# EAGLE design in12 (EAGLE 9.6.2)
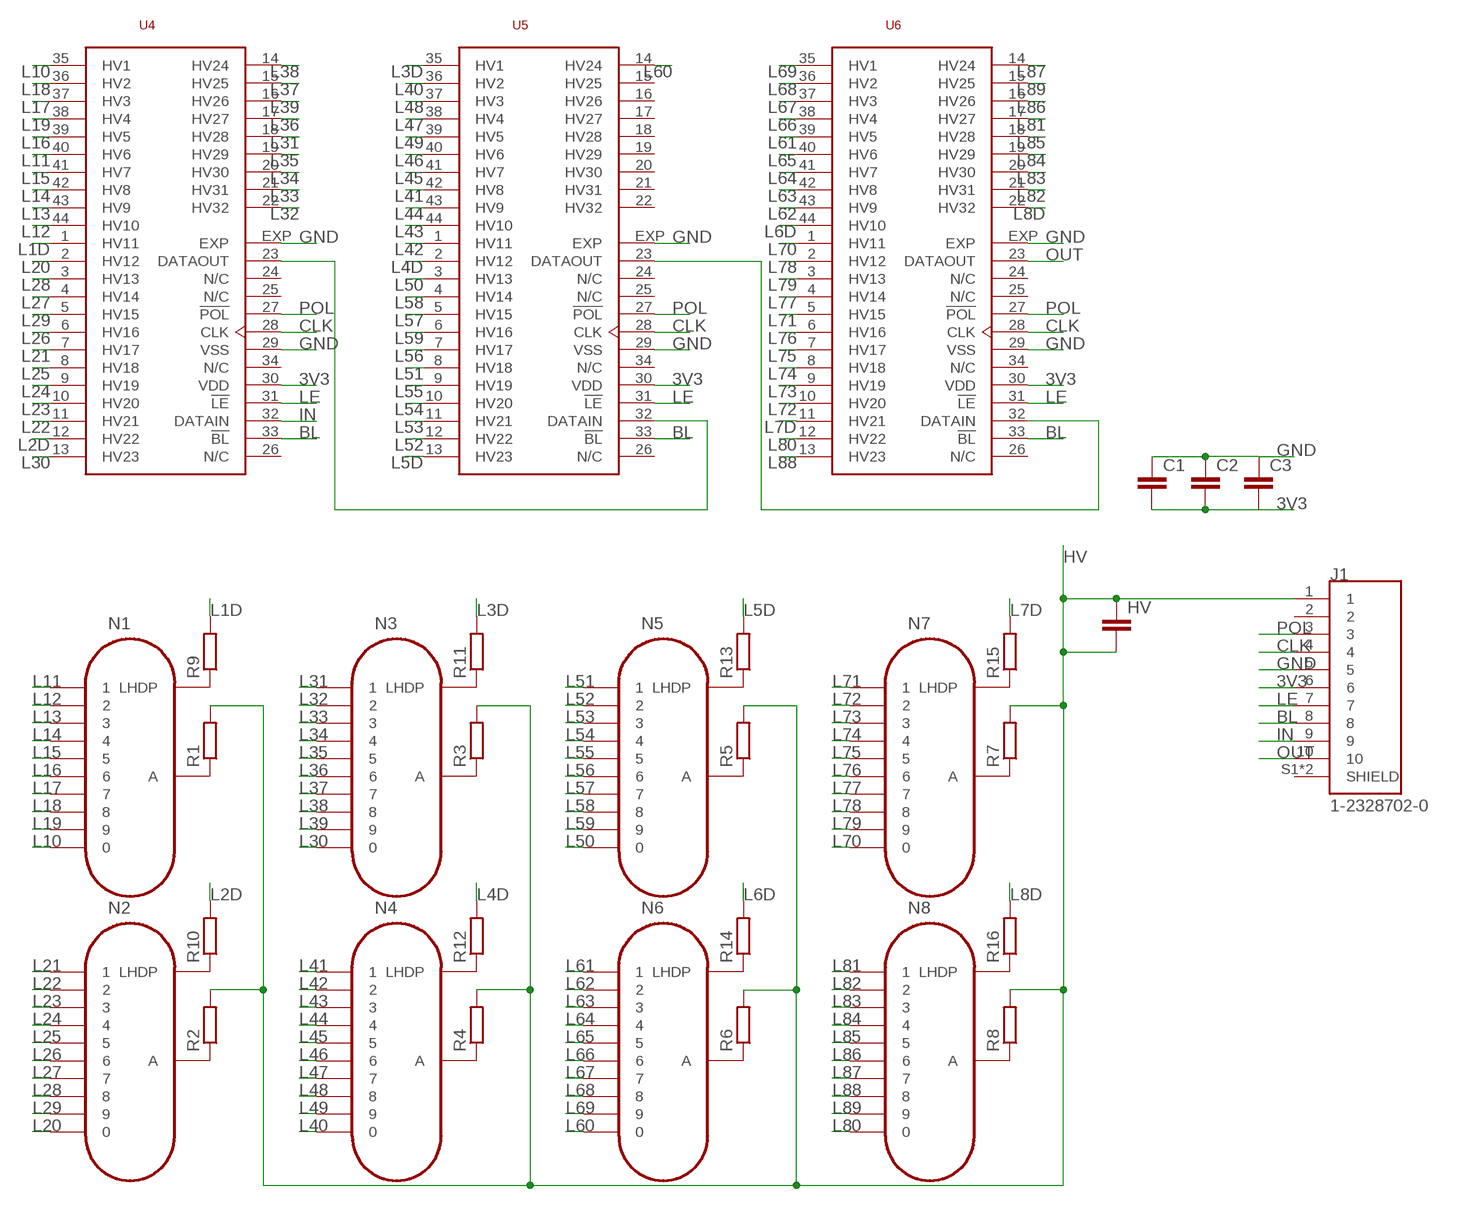
[diagram p0: schematic, sheet 1]

## Parts
C1  C-EUC0805  [C0805]
C2  C-EUC0805  [C0805]
C3  C-EUC0805  [C0805]
HV  C-EUC1206  [C1206]
J1  1-2328702-0  [TE_1-2328702-0]
N1  IN-12B  [IN-12]
N2  IN-12B  [IN-12]
N3  IN-12B  [IN-12]
N4  IN-12B  [IN-12]
N5  IN-12B  [IN-12]
N6  IN-12B  [IN-12]
N7  IN-12B  [IN-12]
N8  IN-12B  [IN-12]
R1  R-EU_R1206  [R1206]
R2  R-EU_R1206  [R1206]
R3  R-EU_R1206  [R1206]
R4  R-EU_R1206  [R1206]
R5  R-EU_R1206  [R1206]
R6  R-EU_R1206  [R1206]
R7  R-EU_R1206  [R1206]
R8  R-EU_R1206  [R1206]
R9  R-EU_R0805  [R0805]
R10  R-EU_R0805  [R0805]
R11  R-EU_R0805  [R0805]
R12  R-EU_R0805  [R0805]
R13  R-EU_R0805  [R0805]
R14  R-EU_R0805  [R0805]
R15  R-EU_R0805  [R0805]
R16  R-EU_R0805  [R0805]
U4  HV5523  [QFN-44-7X7]
U5  HV5523  [QFN-44-7X7]
U6  HV5523  [QFN-44-7X7]

## Nets
3V3: C1.2 C2.2 C3.2 J1.6 U4.30(VDD) U5.30(VDD) U6.30(VDD)
BL: J1.8 U4.33(!BL) U5.33(!BL) U6.33(!BL)
CLK: J1.4 U4.28(CLK) U5.28(CLK) U6.28(CLK)
GND: C1.1 C2.1 C3.1 J1.5 U4.29(VSS) U4.EXP U5.29(VSS) U5.EXP U6.29(VSS) U6.EXP
HV: HV.1 HV.2 J1.1 R1.2 R2.2 R3.2 R4.2 R5.2 R6.2 R7.2 R8.2
IN: J1.9 U4.32(DATAIN)
L1D: R9.2 U4.1(HV11)
L2D: R10.2 U4.12(HV22)
L3D: R11.2 U5.35(HV1)
L4D: R12.2 U5.2(HV12)
L5D: R13.2 U5.13(HV23)
L6D: R14.2 U6.44(HV10)
L7D: R15.2 U6.11(HV21)
L8D: R16.2 U6.22(HV32)
L10: N1.0 U4.35(HV1)
L11: N1.1 U4.40(HV6)
L12: N1.2 U4.44(HV10)
L13: N1.3 U4.43(HV9)
L14: N1.4 U4.42(HV8)
L15: N1.5 U4.41(HV7)
L16: N1.6 U4.39(HV5)
L17: N1.7 U4.37(HV3)
L18: N1.8 U4.36(HV2)
L19: N1.9 U4.38(HV4)
L20: N2.0 U4.2(HV12)
L21: N2.1 U4.7(HV17)
L22: N2.2 U4.11(HV21)
L23: N2.3 U4.10(HV20)
L24: N2.4 U4.9(HV19)
L25: N2.5 U4.8(HV18)
L26: N2.6 U4.6(HV16)
L27: N2.7 U4.4(HV14)
L28: N2.8 U4.3(HV13)
L29: N2.9 U4.5(HV15)
L30: N3.0 U4.13(HV23)
L31: N3.1 U4.18(HV28)
L32: N3.2 U4.22(HV32)
L33: N3.3 U4.21(HV31)
L34: N3.4 U4.20(HV30)
L35: N3.5 U4.19(HV29)
L36: N3.6 U4.17(HV27)
L37: N3.7 U4.15(HV25)
L38: N3.8 U4.14(HV24)
L39: N3.9 U4.16(HV26)
L40: N4.0 U5.36(HV2)
L41: N4.1 U5.42(HV8)
L42: N4.2 U5.1(HV11)
L43: N4.3 U5.44(HV10)
L44: N4.4 U5.43(HV9)
L45: N4.5 U5.41(HV7)
L46: N4.6 U5.40(HV6)
L47: N4.7 U5.38(HV4)
L48: N4.8 U5.37(HV3)
L49: N4.9 U5.39(HV5)
L50: N5.0 U5.3(HV13)
L51: N5.1 U5.8(HV18)
L52: N5.2 U5.12(HV22)
L53: N5.3 U5.11(HV21)
L54: N5.4 U5.10(HV20)
L55: N5.5 U5.9(HV19)
L56: N5.6 U5.7(HV17)
L57: N5.7 U5.5(HV15)
L58: N5.8 U5.4(HV14)
L59: N5.9 U5.6(HV16)
L60: N6.0 U5.14(HV24)
L61: N6.1 U6.39(HV5)
L62: N6.2 U6.43(HV9)
L63: N6.3 U6.42(HV8)
L64: N6.4 U6.41(HV7)
L65: N6.5 U6.40(HV6)
L66: N6.6 U6.38(HV4)
L67: N6.7 U6.37(HV3)
L68: N6.8 U6.36(HV2)
L69: N6.9 U6.35(HV1)
L70: N7.0 U6.1(HV11)
L71: N7.1 U6.5(HV15)
L72: N7.2 U6.10(HV20)
L73: N7.3 U6.9(HV19)
L74: N7.4 U6.8(HV18)
L75: N7.5 U6.7(HV17)
L76: N7.6 U6.6(HV16)
L77: N7.7 U6.4(HV14)
L78: N7.8 U6.2(HV12)
L79: N7.9 U6.3(HV13)
L80: N8.0 U6.12(HV22)
L81: N8.1 U6.17(HV27)
L82: N8.2 U6.21(HV31)
L83: N8.3 U6.20(HV30)
L84: N8.4 U6.19(HV29)
L85: N8.5 U6.18(HV28)
L86: N8.6 U6.16(HV26)
L87: N8.7 U6.14(HV24)
L88: N8.8 U6.13(HV23)
L89: N8.9 U6.15(HV25)
LE: J1.7 U4.31(!LE) U5.31(!LE) U6.31(!LE)
N$1: N1.A R1.1
N$2: N2.A R2.1
N$3: N3.A R3.1
N$4: N4.A R4.1
N$5: N5.A R5.1
N$6: N6.A R6.1
N$7: N7.A R7.1
N$8: N8.A R8.1
N$9: N1.LHDP R9.1
N$10: N2.LHDP R10.1
N$11: N3.LHDP R11.1
N$12: N4.LHDP R12.1
N$13: N5.LHDP R13.1
N$14: N6.LHDP R14.1
N$15: N7.LHDP R15.1
N$16: N8.LHDP R16.1
N$17: U4.23(DATAOUT) U5.32(DATAIN)
N$18: U5.23(DATAOUT) U6.32(DATAIN)
OUT: J1.10 U6.23(DATAOUT)
POL: J1.3 U4.27(!POL) U5.27(!POL) U6.27(!POL)
Unconnected: J1.2 J1.S1(SHIELD) J1.S2(SHIELD) U4.24(N/C) U4.25(N/C) U4.26(N/C) U4.34(N/C) U5.15(HV25) U5.16(HV26) U5.17(HV27) U5.18(HV28) U5.19(HV29) U5.20(HV30) U5.21(HV31) U5.22(HV32) U5.24(N/C) U5.25(N/C) U5.26(N/C) U5.34(N/C) U6.24(N/C) U6.25(N/C) U6.26(N/C) U6.34(N/C)

## Library data of the parts
C1-C3 HV = rcl:C-EU: CAPACITOR, European symbol; SPICEPREFIX: C
J1 = 1-2328702-0:1-2328702-0: Receptacle Connector 10PIN 0.5MMP FPC CONN, BACK FLIP LOCK 10 POS Check availability <https://pricing.snapeda.com/parts/1-2328702-0/TE%20Connectivity/view-part?ref=eda>; AVAILABILITY: In Stock; CHECK_PRICES: https://www.snapeda.com/parts/1-2328702-0/TE+Connectivity+AMP+Connectors/view-part/?ref=eda; COMMENT: 1-2328702-0; DESCRIPTION: FPC Connector; 0.5mm pitch dual contact back flip FPC, 10pos | TE Connectivity 1-2328702-0; MF: TE Connectivity; MP: 1-2328702-0; PACKAGE: None; PRICE: None; PURCHASE-URL: https://www.snapeda.com/api/url_track_click_mouser/?unipart_id=3106381&manufacturer=TE Connectivity&part_name=1-2328702-0&search_term=1-2328702-0; SNAPEDA_LINK: https://www.snapeda.com/parts/1-2328702-0/TE+Connectivity+AMP+Connectors/view-part/?ref=snap
N1-N8 = russian-nixies:IN-12B: IN-12B: medium numeric topview nixie tube
R1-R16 = rcl:R-EU_: RESISTOR, European symbol; SPICEPREFIX: R
U4-U6 = nixiemisc:HV5523

## Board
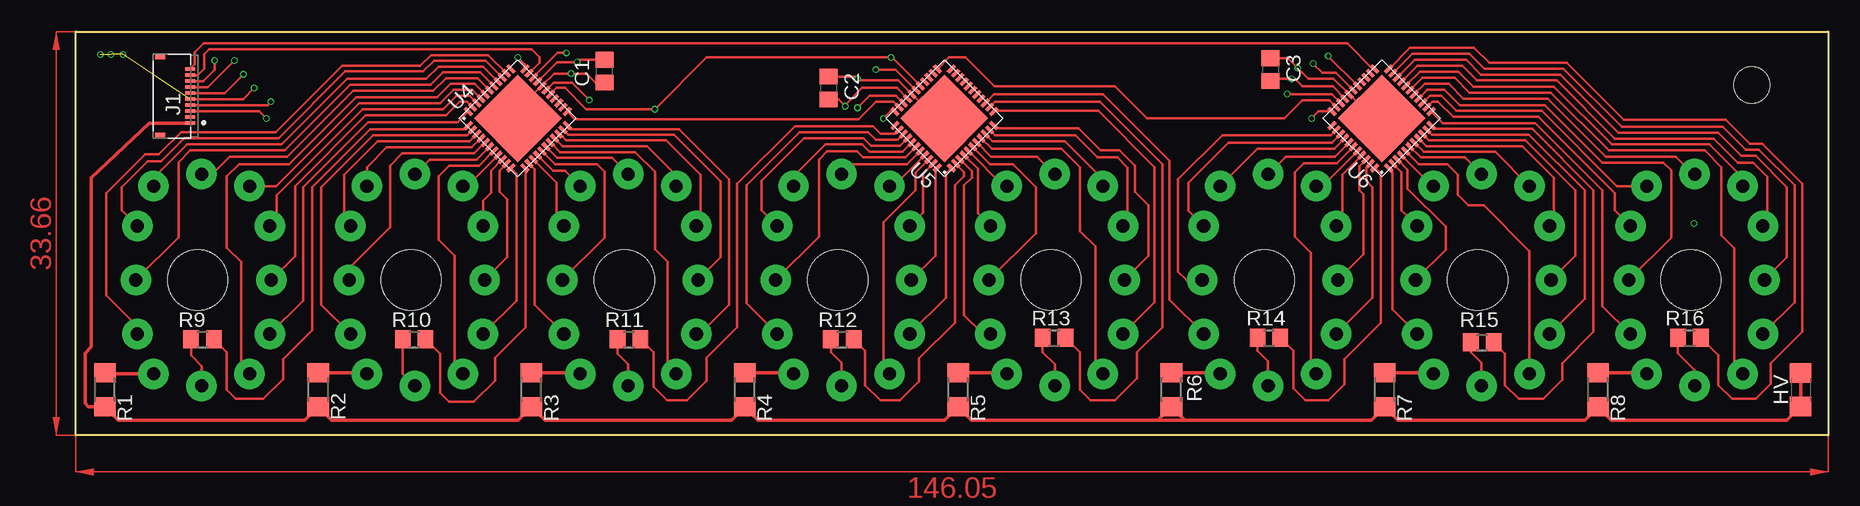
[diagram p1: board, top side]
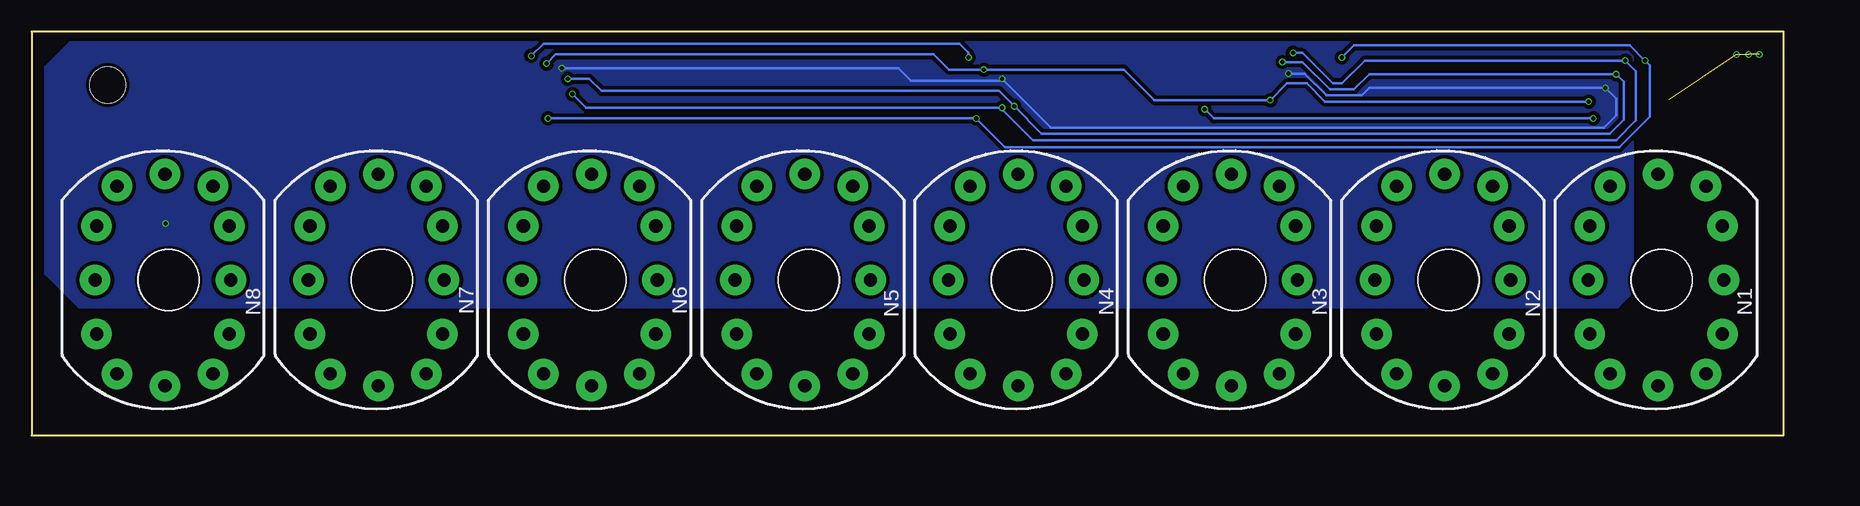
[diagram p2: board, bottom side, seen from below]

Size 146.05 x 33.66 mm. Coordinates in mm from the lower left corner, seen from the top.
Outline: 0,0 0,33.66 146.05,33.66 146.05,0 0,0
Copper layers (1*16): Top 0.035mm / dielectric 1.5mm / Bottom 0.035mm
Design rules "PCBWay_2L_100um-Track": minimum track width 0.1mm, minimum drill 0.3mm, track to track 0.1mm, track to pad 0.1mm, pad to pad 0.1mm, via to via 0.1mm, smd to smd 0mil, copper to edge 0.3mm, drill to drill 10mil, minimum pad ring 6mil, minimum via ring 0.1mm, stop-mask expansion 2mil, vias tented up to drill 0.45mm, thermal gap 0.2mm
Holes 3 mm at 139.7,29.21

### Footprints (pad centres in the part's own frame; a part is rotated, then mirrored left to right if it is on the bottom)
C0805 = smd 1.3 x 1.5: 1 -0.95,0; 2 0.95,0
C1206 = smd 1.6 x 1.8: 1 -1.4,0; 2 1.4,0
TE_1-2328702-0 = smd 0.3 x 0.8: 1 0,0; 2 -0.5,0; 3 -1,0; 4 -1.5,0; 5 -2,0; 6 -2.5,0; 7 -3,0; 8 -3.5,0; 9 -4,0; 10 -4.5,0 | smd 0.4 x 0.8: S1 1,-2.5; S2 -5.5,-2.5
IN-12 = drill 1.1 pad 2.54: 0 5.048,-4.5; 1 -4.317,-7.817; 2 -6,-4.5; 3 -6.127,0; 4 -6,4.5; 5 -4.317,7.817; 6 -0.318,8.818; 7 3.683,7.817; 8 5.048,4.5; 9 5.175,0; A 3.683,-7.817; LHDP -0.318,-8.818 | hole 5: 0,0
R1206 = smd 1.6 x 1.803: 1 -1.422,0; 2 1.422,0
R0805 = smd 1.3 x 1.5: 1 -0.95,0; 2 0.95,0
QFN-44-7X7 = smd 0.8 x 0.3: 1 -3.325,2.5; 2 -3.325,2; 3 -3.325,1.5; 4 -3.325,1; 5 -3.325,0.5; 6 -3.325,0; 7 -3.325,-0.5; 8 -3.325,-1; 9 -3.325,-1.5; 10 -3.325,-2; 11 -3.325,-2.5; 23 3.325,-2.5; 24 3.325,-2; 25 3.325,-1.5; 26 3.325,-1; 27 3.325,-0.5; 28 3.325,0; 29 3.325,0.5; 30 3.325,1; 31 3.325,1.5; 32 3.325,2; 33 3.325,2.5 | smd 0.3 x 0.8: 12 -2.5,-3.325; 13 -2,-3.325; 14 -1.5,-3.325; 15 -1,-3.325; 16 -0.5,-3.325; 17 0,-3.325; 18 0.5,-3.325; 19 1,-3.325; 20 1.5,-3.325; 21 2,-3.325; 22 2.5,-3.325; 34 2.5,3.325; 35 2,3.325; 36 1.5,3.325; 37 1,3.325; 38 0.5,3.325; 39 0,3.325; 40 -0.5,3.325; 41 -1,3.325; 42 -1.5,3.325; 43 -2,3.325; 44 -2.5,3.325 | smd 5.15 x 5.15: EXP 0,0

### Placement (x,y rotation side)
C1  44.07,30.35 90 top
C2  62.74,28.96 270 top
C3  99.57,30.48 270 top
HV  143.76,3.81 270 top
J1  9.53,26.04 270 top
N1  10.16,12.95 0 bottom
N2  27.94,12.95 0 bottom
N3  45.72,12.95 0 bottom
N4  63.5,12.95 0 bottom
N5  81.28,12.95 0 bottom
N6  99.06,12.95 0 bottom
N7  116.84,12.95 0 bottom
N8  134.62,12.95 0 bottom
R1  2.41,3.81 270 top
R2  20.19,3.81 270 top
R3  37.97,3.81 270 top
R4  55.75,3.81 270 top
R5  73.53,3.81 270 top
R6  91.31,3.81 270 top
R7  109.09,3.81 270 top
R8  126.87,3.81 270 top
R9  10.54,8 0 top
R10  28.19,8 0 top
R11  46.1,8 0 top
R12  63.88,8 0 top
R13  81.53,8.13 0 top
R14  99.44,8.13 0 top
R15  117.22,7.75 0 top
R16  134.49,8.13 0 top
U4  36.83,26.42 45 top
U5  72.39,26.42 135 top
U6  108.84,26.42 135 top

### Tracks (layer width: path | path; a pad name or v marks a point on that pad's centre or on a via)
3V3  (via drill 0.35)
  Top 0.203: J1.6 12.41,28.54 v13.97,30.1 | U4.30 40.12,31.11 v41.78,31.11 41.97,31.3 C1.2 | U6.30 104.76,29.08 102.23,29.08 101.6,29.72 v101.35,29.72 99.57,29.72 C3.2 | U5.30 68.44,28.96 65.53,28.96 64.14,27.56 v64.14,27.43 63.56,28.01 C2.2
  Bottom 0.203: v41.78,31.11 40.13,31.11 37.85,28.83 35.81,28.83 34.54,30.1 v13.97,30.1 13.34,29.46 13.34,26.29 14.48,25.15 61.85,25.15 v64.14,27.43 65.41,28.7 98.55,28.7 99.57,29.72 v101.35,29.72
BL  (via drill 0.35)
  Top 0.203: J1.8 10.61,29.54 11.56,30.48 v11.56,31.24 | v36.83,31.5 37.41,30.91 U4.33 | v67.31,26.42 67.89,27 U5.33 | v103,26.42 103.58,27 U6.33
  Bottom 0.203: v36.83,31.5 35.81,32.51 12.83,32.51 v11.56,31.24 11.18,30.86 11.18,26.54 13.72,24 64.9,24 v67.31,26.42 v103,26.42
CLK  (via drill 0.35)
  Top 0.203: U6.28 105.03,30.23 103.89,30.23 v103.12,30.99 | v66.67,30.48 68.33,30.48 U5.28 | U4.28 39.81,29.4 41.34,29.4 v42.8,27.94 | v16.26,27.81 15.98,27.54 J1.4
  Bottom 0.203: v103.12,30.99 102.36,31.75 70.87,31.75 69.6,30.48 v66.67,30.48 54.99,30.48 52.45,27.94 v42.8,27.94 41.4,29.34 39.75,29.34 38.23,27.81 v16.26,27.81
GND  (via drill 0.35)  (3 unrouted)
  Top 0.203: U5.EXP 71.68,26.42 U5.29 68.51,29.59 65.28,29.59 v65.15,29.72 64.96,29.91 C2.1 | U6.EXP 108.13,26.42 U6.29 104.83,29.72 102.75,29.72 v101.86,30.61 v101.85,30.61 101.03,31.43 C3.1 | U4.EXP 36.83,27.12 U4.29 39.87,30.16 v41.27,30.16 42.55,30.16 43.31,29.4 C1.1 | J1.5 13.94,28.04 v14.86,28.96
  Bottom 0.203: v41.27,30.16 39.94,30.16 38.12,28.35 35.15,28.35 34.54,28.96 v14.86,28.96 13.97,28.07 13.97,26.67 14.98,25.66 61.09,25.66 v65.15,29.72 65.3,29.57 72.75,29.57 73.79,30.61 v101.85,30.61
  other vias: 2.03,31.75 2.92,31.75 3.94,31.75 134.87,17.65
  pour Bottom (isolate 0.305): 12.57,32.77 12.57,11.94 13.84,10.67 142.11,10.67 144.78,13.34 144.91,13.46 144.91,30.73 142.88,32.77
HV
  Top 0.305: 90.19,1.27 74.65,1.27 R5.2 72.42,1.27 56.87,1.27 R4.2 54.63,1.27 39.09,1.27 R3.2 36.85,1.27 21.31,1.27 R2.2 19.07,1.27 3.53,1.27 R1.2 1.04,2.39 0.76,2.67 0.76,6.86 1.29,7.38 1.29,21.47 6.12,26.04 J1.1 | 90.19,1.27 92.43,1.27 | 92.43,1.27 107.97,1.27 R7.2 110.21,1.27 125.75,1.27 R8.2 127.99,1.27 142.62,1.27 HV.2 HV.1 | 92.43,1.27 R6.2 90.19,1.27
IN
  Top 0.203: J1.9 10.16,30.04 10.7,30.57 10.7,31.78 11.1,32.18 37.97,32.18 38.65,31.5 38.65,31.07 U4.32
L1D
  Top 0.203: U4.1 32.41,25.53 29.8,25.53 24.53,25.53 19.68,20.69 19.68,8.76 17.27,6.35 17.27,4.7 15.62,3.05 13.34,3.05 12.57,3.81 12.57,6.92 R9.2
L2D
  Top 0.203: U4.12 37.47,22.25 37.47,9.02 34.92,6.48 34.92,4.57 33.15,2.79 31.11,2.79 30.35,3.56 30.35,6.79 R10.2
L3D
  Top 0.203: U5.35 68.29,25.15 67.06,25.15 66.42,25.78 59.94,25.78 55.12,20.95 55.12,9.02 52.58,6.48 52.58,4.57 50.93,2.92 49.28,2.92 48.13,4.06 48.13,6.92 R11.2
L4D
  Top 0.203: U5.2 74.04,21.94 74.04,21.59 73.28,20.83 73.28,9.4 70.29,6.41 70.29,4.51 68.71,2.92 67.06,2.92 65.79,4.19 65.79,7.05 R12.2
L5D
  Top 0.203: U5.13 76.61,27.81 85.34,27.81 90.55,22.6 90.55,9.02 88.46,6.92 88.46,4.76 86.61,2.92 84.58,2.92 83.69,3.81 83.69,6.92 R13.2
L6D
  Top 0.203: U6.44 108.76,21.79 108.76,9.4 105.73,6.36 105.73,4.25 104.39,2.92 102.49,2.92 101.47,3.94 101.47,7.05 R14.2
L7D
  Top 0.203: U6.11 113.25,25.55 121.39,25.55 126.49,20.45 126.49,8.64 123.89,6.03 123.89,4.64 122.3,3.05 120.27,3.05 119.13,4.19 119.13,6.79 R15.2
L8D
  Top 0.203: U6.22 111.19,32.3 116.54,32.3 117.81,31.04 124.28,31.04 129.03,26.29 137.54,26.29 139.53,24.3 140.55,24.3 143.89,20.95 143.89,8.64 141.25,6 141.25,4.29 140.01,3.05 138.05,3.05 136.91,4.19 136.91,6.67 R16.2
L10
  Top 0.203: N1.0 5.11,9.11 2.54,11.68 2.54,20.19 5.78,23.43 6.92,23.43 8.76,25.27 16.65,25.27 22.18,30.81 28.7,30.81 29.59,31.7 34.38,31.7 U4.35
L11
  Top 0.203: N1.1 13.78,5.84 13.78,14.45 12.57,15.66 12.57,21.59 13.59,22.61 17.79,22.61 23.35,28.17 30.11,28.17 31.24,29.3 33.23,29.3 U4.40
L12
  Top 0.203: N1.2 18.95,11.24 18.95,20.7 24.36,26.11 31.82,26.11 U4.44
L13
  Top 0.203: N1.3 18.26,14.93 18.26,20.77 24.16,26.67 30.87,26.67 32,27.8 32.61,27.8 U4.43
L14
  Top 0.203: N1.4 16.74,18.03 16.74,20 23.89,27.16 30.61,27.16 31.75,28.3 32.82,28.3 U4.42
L15
  Top 0.203: U4.41 33.03,28.8 31.5,28.8 30.38,27.69 23.62,27.69 16.71,20.77 N1.5
L16
  Top 0.203: U4.39 33.48,29.77 30.86,29.77 29.79,28.7 23.11,28.7 17.63,23.22 12.8,23.22 11.36,21.77 N1.6
L17
  Top 0.203: N1.7 6.35,20.9 6.35,21.34 9.27,24.26 17.14,24.26 22.61,29.72 29.21,29.72 30.23,30.73 33.93,30.73 U4.37
L18
  Top 0.203: N1.8 3.81,18.76 3.81,20.7 5.97,22.86 7.11,22.86 9.02,24.77 16.9,24.77 22.46,30.33 28.96,30.33 29.84,31.22 34.15,31.22 U4.36
L19
  Top 0.203: U4.38 33.7,30.25 30.61,30.25 29.57,29.21 22.86,29.21 17.4,23.75 9.53,23.75 8.57,22.79 8.57,16.53 N1.9
L20
  Top 0.203: N2.0 20.45,10.9 20.45,20.69 24.77,25.02 32.6,25.02 U4.2
L21
  Top 0.203: N2.1 31.56,5.84 31.56,14.96 30.23,16.29 30.23,21.59 31.11,22.48 33.6,22.48 U4.7
L22
  Top 0.203: N2.2 36.73,11.24 36.73,21.82 U4.11
L23
  Top 0.203: N2.3 35.94,14.83 35.94,19.68 35.31,20.32 35.31,22.06 U4.10
L24
  Top 0.203: N2.4 33.94,19.56 34.59,20.21 34.59,22.05 U4.9
L25
  Top 0.203: U4.8 32.6,20.77 N2.5
L26
  Top 0.203: U4.6 33.4,22.99 29.47,22.99 N2.6
L27
  Top 0.203: N2.7 24.26,22.35 25.91,24 33,24 U4.4
L28
  Top 0.203: U4.3 32.8,24.51 25.15,24.51 22.35,21.71 22.35,17.99 N2.8
L29
  Top 0.203: U4.5 33.2,23.5 27.19,23.5 26.18,22.49 26.18,17.37 22.77,13.95 N2.9
L30
  Top 0.203: N3.0 38.23,10.9 38.23,22.19 U4.13
L31
  Top 0.203: N3.1 49.34,5.84 49.34,14.45 48.26,15.53 48.26,21.96 46.61,23.61 40.35,23.61 U4.18
L32
  Top 0.203: N3.2 52.04,8.45 54.46,10.87 54.46,21.36 50.29,25.53 41.25,25.53 U4.22
L33
  Top 0.203: N3.3 53.72,14.83 53.72,21.2 49.86,25.06 41.01,25.06 U4.21
L34
  Top 0.203: N3.4 52.07,17.8 52.07,21.71 49.2,24.58 40.84,24.58 40.29,25.13 U4.20
L35
  Top 0.203: N3.5 50.04,21.66 47.6,24.1 40.56,24.1 U4.19
L36
  Top 0.203: N3.6 44.69,23.12 40.12,23.12 U4.17
L37
  Top 0.203: N3.7 40.77,22.04 40.77,22.05 39.78,22.05 U4.15
L38
  Top 0.203: N3.8 40.07,18.05 40.07,21.05 U4.14
L39
  Top 0.203: N3.9 44.07,16.48 44.07,21.97 43.43,22.61 39.93,22.61 U4.16
L40
  Top 0.203: N4.0 55.88,11.03 55.88,20.83 60.33,25.27 66.04,25.27 66.67,24.64 68.49,24.64 U5.36
L41
  Top 0.203: N4.1 67.31,5.64 67.31,17.78 69.98,20.45 69.98,21.88 U5.42
L42
  Top 0.203: N4.2 72.52,11.47 72.52,21.84 U5.1
L43
  Top 0.203: N4.3 71.66,14.99 71.66,22.13 71.81,22.28 U5.44
L44
  Top 0.203: U5.43 70.61,21.81 70.61,18.57 N4.4
L45
  Top 0.203: U5.41 68.22,20.83 67.87,20.83 N4.5
L46
  Top 0.203: N4.6 64.65,22.61 69.29,22.61 U5.40
L47
  Top 0.203: U5.38 68.91,23.65 66.15,23.65 65.54,24.26 62.48,24.26 59.82,21.59 N4.7
L48
  Top 0.203: N4.8 57.15,18.76 57.15,21.21 60.71,24.77 65.66,24.77 66.29,24.13 68.69,24.13 U5.37
L49
  Top 0.203: N4.9 61.93,16.56 61.93,22.99 62.62,23.68 65.11,23.68 65.62,23.16 69.14,23.16 U5.39
L50
  Top 0.203: N5.0 75.62,8.45 74.04,10.03 74.04,20.83 74.68,21.46 74.68,22.01 U5.3
L51
  Top 0.203: U5.8 76.34,23.88 82.17,23.88 83.69,22.35 83.69,17.02 84.96,15.75 84.96,5.77 N5.1
L52
  Top 0.203: N5.2 89.92,11.09 89.92,22.35 85.22,27.05 76.56,27.05 U5.12
L53
  Top 0.203: N5.3 89.41,14.96 89.41,19.18 88.27,20.32 88.27,22.48 87,23.75 85.4,23.75 83.57,25.58 76.76,25.58 U5.11
L54
  Top 0.203: N5.4 87.66,17.84 87.66,22.32 86.81,23.18 85.15,23.18 83.31,25.02 76.61,25.02 U5.10
L55
  Top 0.203: U5.9 76.42,24.51 82.42,24.51 85.6,21.34 N5.5
L56
  Top 0.203: U5.7 76.27,23.24 80.13,23.24 N5.6
L57
  Top 0.203: U5.5 77.33,20.77 N5.7
L58
  Top 0.203: U5.4 75.18,22.21 75.18,18.5 N5.8
L59
  Top 0.203: N5.9 80.01,16.86 80.01,20.7 78.11,22.61 76.2,22.61 U5.6
L60
  Top 0.203: N6.0 91.16,11.31 91.16,22.89 85.6,28.45 76.54,28.45 U5.14
L61
  Top 0.203: N6.1 102.93,5.58 102.93,15.21 101.6,16.55 101.6,21.91 102.37,22.68 105.11,22.68 U6.39
L62
  Top 0.203: U6.43 107.57,22.32 107.57,21.21 108.08,20.7 108.08,11.47 N6.2
L63
  Top 0.203: U6.42 106.97,22.42 106.97,20.45 107.31,20.1 107.31,15.08 N6.3
L64
  Top 0.203: N6.4 105.57,17.96 105.57,21.73 U6.41
L65
  Top 0.203: N6.5 103.9,20.77 U6.40
L66
  Top 0.203: N6.6 100.85,23.24 104.96,23.24 U6.38
L67
  Top 0.203: N6.7 98.48,23.88 104.9,23.88 105.78,24.75 U6.37
L68
  Top 0.203: N6.8 92.74,18.72 92.74,21.05 96.07,24.38 104.69,24.38 U6.36
L69
  Top 0.203: N6.9 92.55,12.95 91.87,13.63 91.87,21.34 95.55,25.02 104.61,25.02 U6.35
L70
  Top 0.203: N7.0 109.73,10.52 109.73,21.99 U6.1
L71
  Top 0.203: N7.1 121.16,15.37 117.35,19.18 116.08,19.18 115.19,20.07 115.19,21.72 114.3,22.61 111.94,22.61 U6.5
L72
  Top 0.203: N7.2 125.75,11.37 125.75,20.42 121.11,25.06 113.02,25.06 U6.10
L73
  Top 0.203: N7.3 124.97,14.96 124.97,20.45 120.81,24.61 112.77,24.61 U6.9
L74
  Top 0.203: N7.4 123.19,17.8 123.19,21.46 120.55,24.11 112.56,24.11 U6.8
L75
  Top 0.203: U6.7 112.34,23.62 118.31,23.62 N7.5
L76
  Top 0.203: N7.6 115.77,23.16 112.09,23.16 U6.6
L77
  Top 0.203: U6.4 113.07,20.77 N7.7
L78
  Top 0.203: N7.8 110.49,18.76 110.49,21.94 U6.2
L79
  Top 0.203: N7.9 114.19,15.48 114.19,17.38 111,20.57 111,22.14 U6.3
L80
  Top 0.203: N8.0 127.25,10.77 127.25,20.45 121.67,26.04 113.92,26.04 U6.12
L81
  Top 0.203: N8.1 138.24,5.84 138.24,15.6 137.16,16.67 137.16,22.35 135.76,23.75 127.76,23.75 122.94,28.57 116.17,28.57 114.94,29.8 112.23,29.8 U6.17
L82
  Top 0.203: N8.2 143.26,11.09 143.26,20.83 140.27,23.81 139.18,23.81 137.29,25.7 128.84,25.7 123.99,30.56 117.4,30.56 116.15,31.8 111.4,31.8 U6.21
L83
  Top 0.203: N8.3 142.62,14.83 142.62,20.7 140.02,23.3 138.82,23.3 136.91,25.22 128.57,25.22 123.72,30.07 117.12,30.07 115.89,31.3 111.61,31.3 U6.20
L84
  Top 0.203: N8.4 141,17.84 141,21.56 139.83,22.73 138.53,22.73 136.53,24.74 128.29,24.74 123.44,29.59 116.78,29.59 115.57,30.8 111.81,30.8 U6.19
L85
  Top 0.203: N8.5 138.94,21.46 136.14,24.26 128.01,24.26 123.21,29.06 116.48,29.06 115.24,30.3 112.02,30.3 U6.18
L86
  Top 0.203: U6.16 112.44,29.3 114.43,29.3 115.67,28.07 122.68,28.07 127.51,23.24 133.35,23.24 134.82,21.77 N8.6
L87
  Top 0.203: U6.14 112.85,28.3 113.81,28.3 115.06,27.05 122.17,27.05 128.45,20.77 N8.7
L88
  Top 0.203: N8.8 128.27,18.76 128.27,20.19 121.92,26.54 114.8,26.54 113.54,27.8 113.06,27.8 U6.13
L89
  Top 0.203: N8.9 132.97,16.48 132.97,22.1 132.33,22.73 127.25,22.73 122.45,27.53 115.34,27.53 114.07,28.8 112.64,28.8 U6.15
LE  (via drill 0.35)
  Top 0.203: J1.7 11,29.04 v13.21,31.24 | v40.89,31.88 40.17,31.88 U4.31 | U6.31 104.69,28.45 v100.97,28.45 | U5.31 68.36,28.32 66.17,28.32 v65.15,27.3
  Bottom 0.203: v40.89,31.88 40.13,31.88 37.59,29.34 36.83,29.34 34.92,31.24 v13.21,31.24 12.32,30.35 12.32,26.26 13.97,24.61 62.59,24.61 65.15,27.17 v65.15,27.3 99.82,27.3 v100.97,28.45
N$1
  Top 0.305: R1.1 2.51,5.14 N1.A
N$2
  Top 0.305: R2.1 24.16,5.23 N2.A
N$3
  Top 0.305: R3.1 41.94,5.23 N3.A
N$4
  Top 0.305: R4.1 59.72,5.23 N4.A
N$5
  Top 0.305: R5.1 77.5,5.23 N5.A
N$6
  Top 0.305: R6.1 95.28,5.23 N6.A
N$7
  Top 0.305: R7.1 113.06,5.23 N7.A
N$8
  Top 0.305: R8.1 130.84,5.23 N8.A
N$9
  Top 0.203: R9.1 9.59,6.67 10.48,5.78 N1.LHDP
N$10
  Top 0.203: R10.1 27.24,5.15 N2.LHDP
N$11
  Top 0.203: R11.1 45.15,6.8 46.04,5.92 N3.LHDP
N$12
  Top 0.203: R12.1 62.93,6.93 63.82,6.04 N4.LHDP
N$13
  Top 0.203: R13.1 80.58,6.93 81.6,5.92 N5.LHDP
N$14
  Top 0.203: R14.1 98.49,7.05 99.38,6.17 N6.LHDP
N$15
  Top 0.203: R15.1 116.27,6.93 117.16,6.04 N7.LHDP
N$16
  Top 0.203: R16.1 133.54,6.86 135.12,5.28 135.12,4.45 134.94,4.26 N8.LHDP
N$17
  Top 0.203: U4.23 41.58,26.36 65.23,26.36 66.67,27.81 68.17,27.81 U5.32
N$18
  Top 0.203: U5.23 72.77,31.5 74.17,31.5 76.58,29.08 86.61,29.08 89.28,26.42 100.73,26.42 102.23,27.92 104.5,27.92 U6.32
OUT
  Top 0.203: U6.23 108.12,30.54 105.97,32.69 10.66,32.69 9.91,31.93 9.91,30.92 J1.10
POL  (via drill 0.35)
  Top 0.203: U6.27 104.39,31.57 v104.39,31.62 | U5.27 68.02,31.5 v67.94,31.5 52.58,31.5 v48.26,27.18 42.55,27.18 40.77,28.96 40.08,28.96 U4.27 | J1.3 15.26,27.04 v15.88,26.42
  Bottom 0.203: v104.39,31.62 103.38,32.64 68.71,32.64 67.94,31.88 v67.94,31.5 | v15.88,26.42 47.5,26.42 v48.26,27.18
(copper drawn outside any net)
  shapes: Top area x2